# Altium schematic sheet 3D_Board_View.SchDoc
size A4
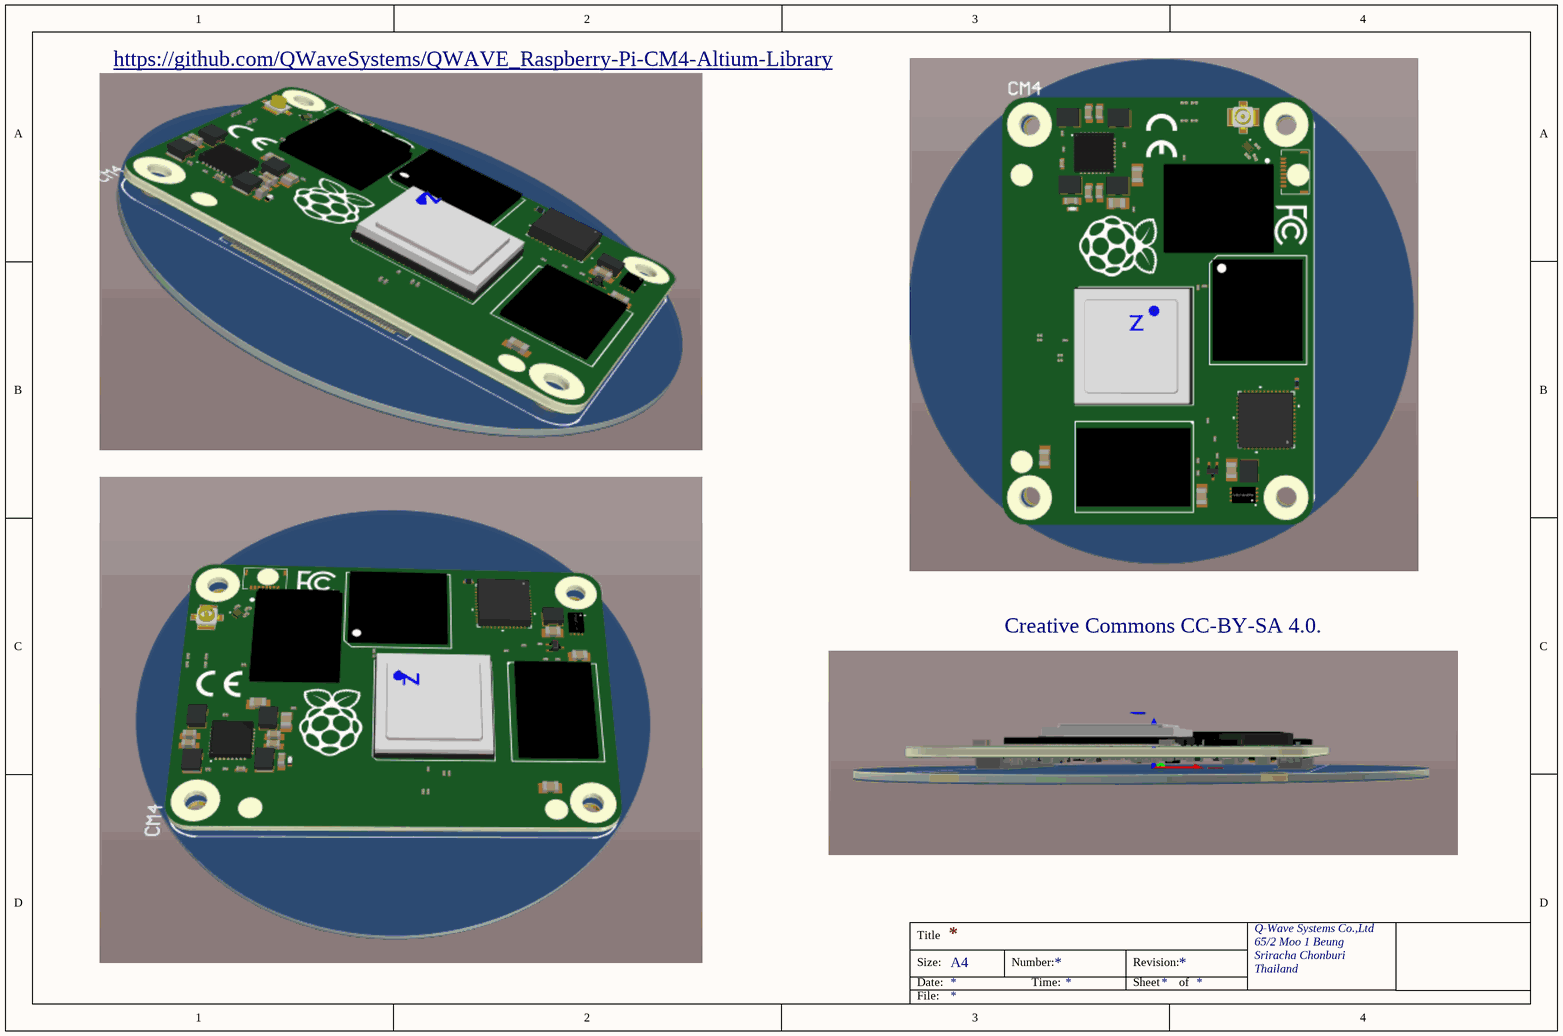
[diagram p0: 3D_Board_View.SchDoc]

## Notes on the sheet
- https://github.com/QWaveSystems/QWAVE_Raspberry-Pi-CM4-Altium-Library
- Creative Commons CC-BY-SA 4.0.
- Title
- Size:
- Date:
- A4
- Number:
- Time:
- Revision:
- Sheet
- of
- Q-Wave Systems Co.,Ltd
- 65/2 Moo 1 Beung
- Sriracha Chonburi
- Thailand
- File: